# Altium schematic sheet 03_MCU1.SchDoc
size A4; DocumentNumber: 3; SheetNumber: 3; SheetTotal: 7
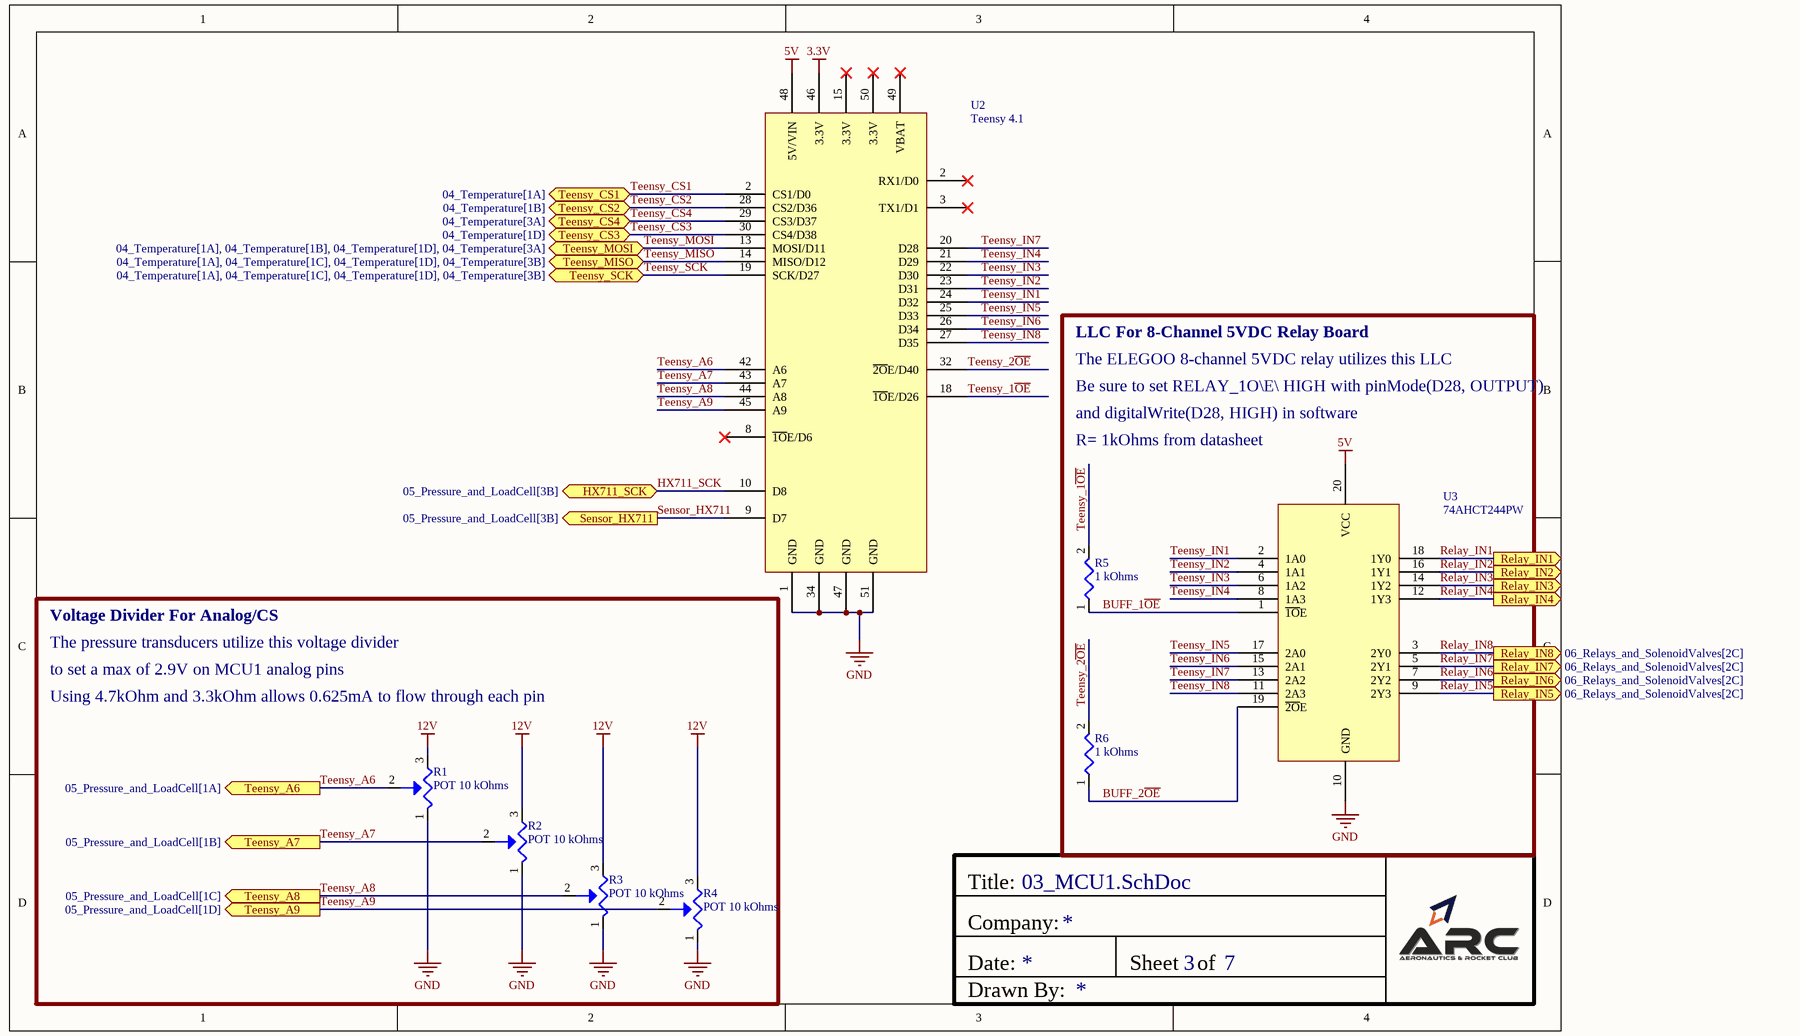
[diagram p0: 03_MCU1.SchDoc]

## Parts
R1  POT 10 kOhms  [3296WL 10K POT]
R2  POT 10 kOhms  [3296WL 10K POT]
R3  POT 10 kOhms  [3296WL 10K POT]
R4  POT 10 kOhms  [3296WL 10K POT]
R5  1 kOhms  [RESC2012X06N]
R6  1 kOhms  [RESC2012X06N]
U2  Teensy 4.1  [Teensy 4.1]
U3  74AHCT244PW  [74AHCT244PW]

## Ports
HX711_SCK (bidir, see 05_Pressure_and_LoadCell[3B]), Relay_IN1 (out, see 06_Relays_and_SolenoidValves[2C]), Relay_IN2 (out, see 06_Relays_and_SolenoidValves[2C]), Relay_IN3 (out, see 06_Relays_and_SolenoidValves[2C]), Relay_IN4 (out, see 06_Relays_and_SolenoidValves[2C]), Relay_IN5 (out, see 06_Relays_and_SolenoidValves[2C]), Relay_IN6 (out, see 06_Relays_and_SolenoidValves[2C]), Relay_IN7 (out, see 06_Relays_and_SolenoidValves[2C]), Relay_IN8 (out, see 06_Relays_and_SolenoidValves[2C]), Sensor_HX711 (out, see 05_Pressure_and_LoadCell[3B]), Teensy_A6 (out, see 05_Pressure_and_LoadCell[1A]), Teensy_A7 (out, see 05_Pressure_and_LoadCell[1B]), Teensy_A8 (out, see 05_Pressure_and_LoadCell[1C]), Teensy_A9 (out, see 05_Pressure_and_LoadCell[1D]), Teensy_CS1 (bidir, see 04_Temperature[1A]), Teensy_CS2 (bidir, see 04_Temperature[1B]), Teensy_CS3 (bidir, see 04_Temperature[1D]), Teensy_CS4 (bidir, see 04_Temperature[3A]), Teensy_MISO (bidir, see 04_Temperature[1A], 04_Temperature[1C], 04_Temperature[1D], 04_Temperature[3B]), Teensy_MOSI (bidir, see 04_Temperature[1A], 04_Temperature[1B], 04_Temperature[1D], 04_Temperature[3A]), Teensy_SCK (bidir, see 04_Temperature[1A], 04_Temperature[1C], 04_Temperature[1D], 04_Temperature[3B])

## Nets
3.3V: U2.46(3.3V)
5V: U2.48(5V/VIN) U3.20(VCC)
12V: R1.3 R2.3 R3.3 R4.3
GND: R1.1 R2.1 R3.1 R4.1 U2.1(GND) U2.34(GND) U2.47(GND) U2.51(GND) U3.10(GND)
BUFF_1~{OE}: R5.1 U3.1(~{1O}E)
BUFF_2~{OE}: R6.1 U3.19(~{2O}E)
HX711_SCK: U2.10(D8) ; port HX711_SCK
Relay_IN1: U3.18(1Y0) ; port Relay_IN1
Relay_IN2: U3.16(1Y1) ; port Relay_IN2
Relay_IN3: U3.14(1Y2) ; port Relay_IN3
Relay_IN4: U3.12(1Y3) ; port Relay_IN4
Relay_IN5: U3.9(2Y3) ; port Relay_IN5
Relay_IN6: U3.7(2Y2) ; port Relay_IN6
Relay_IN7: U3.5(2Y1) ; port Relay_IN7
Relay_IN8: U3.3(2Y0) ; port Relay_IN8
Sensor_HX711: U2.9(D7) ; port Sensor_HX711
Teensy_1~{OE}: R5.2 U2.18(~{1O}E/D26)
Teensy_2~{OE}: R6.2 U2.32(~{2O}E/D40)
Teensy_A6: R1.2 U2.42(A6) ; port Teensy_A6
Teensy_A7: R2.2 U2.43(A7) ; port Teensy_A7
Teensy_A8: R3.2 U2.44(A8) ; port Teensy_A8
Teensy_A9: R4.2 U2.45(A9) ; port Teensy_A9
Teensy_CS1: U2.2(CS1/D0) ; port Teensy_CS1
Teensy_CS2: U2.28(CS2/D36) ; port Teensy_CS2
Teensy_CS3: U2.30(CS4/D38) ; port Teensy_CS3
Teensy_CS4: U2.29(CS3/D37) ; port Teensy_CS4
Teensy_IN1: U2.24(D32) U3.2(1A0)
Teensy_IN2: U2.23(D31) U3.4(1A1)
Teensy_IN3: U2.22(D30) U3.6(1A2)
Teensy_IN4: U2.21(D29) U3.8(1A3)
Teensy_IN5: U2.25(D33) U3.17(2A0)
Teensy_IN6: U2.26(D34) U3.15(2A1)
Teensy_IN7: U2.20(D28) U3.13(2A2)
Teensy_IN8: U2.27(D35) U3.11(2A3)
Teensy_MISO: U2.14(MISO/D12) ; port Teensy_MISO
Teensy_MOSI: U2.13(MOSI/D11) ; port Teensy_MOSI
Teensy_SCK: U2.19(SCK/D27) ; port Teensy_SCK

Not connected (* = marked no-connect by the designer): U2 3(TX1/D1)* 8(~{1O}E/D6)* 15(3.3V)* 49(VBAT)* 50(3.3V)*

## Notes on the sheet
- The ELEGOO 8-channel 5VDC relay utilizes this LLC
- LLC For 8-Channel 5VDC Relay Board
- Be sure to set RELAY_1O\E\ HIGH with pinMode(D28, OUTPUT)
- and digitalWrite(D28, HIGH) in software
- R= 1kOhms from datasheet
- Voltage Divider For Analog/CS
- The pressure transducers utilize this voltage divider
- to set a max of 2.9V on MCU1 analog pins
- Using 4.7kOhm and 3.3kOhm allows 0.625mA to flow through each pin
- Title:
- Company:
- Date:
- Sheet
- of
- Drawn By:

## Library data of the parts
R1-R4 = 3296W-1-103LF: 10 kOhms 0.5W, 1/2W PC Pins Through Hole Trimmer Potentiometer Cermet 25.0 Turn Top Adjustment; Manufacturer: Bourns; Tolerance: 10%; Actuator Orientation: Vertical; Actuator Type: SCREW; Number of Turns: 25; Power: 500mW; Rated Temperature: 70°C; Value: 10kR; Resistance Law: Linear; Rotational Angle: 9000°; Temperature Coefficient: -100100ppm/°C; Lead Diameter: 0.51mm; Lead Length: 6.4mm; Package Height: 10.03mm; Package Length: 9.53mm; Package Width: 4.83mm; Supplier: Digi-Key; Supplier Part Number: 3296W-103LF-ND; Manufacturer Part Number: 3296W-1-103LF; RoHS: Yes; Category: Variable Resistors and Potentiometers; Stock: 20859; Pricing: 1=2.43000, 10=2.13800, 25=1.91680, 50=1.84320, 100=1.76950, 250=1.69580, 500=1.40088, 1000=1.32714, 5000=1.10595 (USD); Mounting Technology: Through Hole; Pins: 3; Package Shape: Rectangular; Case/Package: 3819; Terminal Finish: Tin; Min Operating Temperature: -55°C; Max Operating Temperature: 125°C; JESD-609 Code: e3; Resistor Type: TRIMMER; Construction: Trimmer Pot; Package Style: PCB MountMeter; Packaging: Rail/Tube; Technology: CERMET; Termination: Wire; RoHS Compliant: Yes; Reach SVHC Compliant: No; ComponentLink1URL: https://datasheet.ciiva.com:443/pdfs/VipMasterIC/IC/BOUR/BOUR-S-A0008796795/BOUR-S-A0008796795-1.pdf?src-supplier=IHS+Markit; ComponentLink1Description: https://datasheet.ciiva.com:443/pdfs/VipMasterIC/IC/BOUR/BOUR-S-A0008796795/BOUR-S-A0008796795-1.pdf?src-supplier=IHS+Markit; ComponentLink2URL: https://datasheet.ciiva.com/19454/853572-19454866.pdf?src-supplier=Jameco; ComponentLink2Description: https://datasheet.ciiva.com/19454/853572-19454866.pdf?src-supplier=Jameco; ComponentLink3URL: https://datasheet.ciiva.com/14173/ew3296-dat-e-14173022.pdf?src-supplier=Distrelec; ComponentLink3Description: https://datasheet.ciiva.com/14173/ew3296-dat-e-14173022.pdf?src-supplier=Distrelec; ComponentLink4URL: https://datasheet.ciiva.com/18411/70153578-18411561.pdf?src-supplier=Allied+Electronics; ComponentLink4Description: https://datasheet.ciiva.com/18411/70153578-18411561.pdf?src-supplier=Allied+Electronics; ComponentLink5URL: https://datasheet.ciiva.com/1131/1815117-1131273.pdf?src-supplier=Element14; ComponentLink5Description: https://datasheet.ciiva.com/1131/1815117-1131273.pdf?src-supplier=Element14; ComponentLink6URL: https://datasheet.ciiva.com/3266/3296-3266187.pdf?src-supplier=Avnet; ComponentLink6Description: https://datasheet.ciiva.com/3266/3296-3266187.pdf?src-supplier=Avnet; ComponentLink7URL: https://datasheet.ciiva.com/2156/3296-2156893.pdf?src-supplier=Digi-Key; ComponentLink7Description: https://datasheet.ciiva.com/2156/3296-2156893.pdf?src-supplier=Digi-Key
R5 R6 = RC0805FR-7W1KL Yageo: 1 kOhms ±1% 0.25W, 1/4W Chip Resistor 0805 (2012 Metric) Moisture Resistant Thick Film; Manufacturer: Yageo; Value: 1kR; Supplier 1: Digi-Key; Manufacturer Part Number: RC0805FR-7W1KL; RoHS: Yes; Category: Chip SMD Resistors; Stock 1: 15000; Pricing 1: 5000=0.01838, 10000=0.01715, 25000=0.01629, 50000=0.01596, 125000=0.01562 (USD); Case/Package: 0805; Tolerance: 1%; RoHS Compliant: Yes; Supplier Part Number 1: 13-RC0805FR-7W1KLTR-ND
U2 = Teensy 4.1: RT1062 Teensy 4.1 - ARM® Cortex®-M7 MCU 32-Bit Embedded Evaluation Board 600 MHz 100 mA RTC Built-in microSD Card reader Arduino IDE compatible; Manufacturer: SparkFun; Manufacturer Part Number: DEV-16996; Supplier 1: Digi-Key; RoHS: No; Category: Embedded Processors and Controllers; Stock 1: 300; Pricing 1: 1=31.88000 (USD); Supplier Part Number 1: 1568-DEV-16996-ND
U3 = 74AHCT244PW: Octal Tri-State Buffer NON-INVERT 5.5V 20TSSOP; Manufacturer: NXP Semiconductors; Manufacturer Part Number: 74AHCT244PW,118; Number of Channels: 8; Operating Supply Voltage: 5V; Propagation Delay: 8.4ns; Min Supply Voltage: 4.5V; Logic Function: Buffer,Inverting; Number of Elements: 2; Number of Bits per Element: 4; High Level Output Current: -8mA; Low Level Output Current: 8mA; Polarity: Non-Inverting; Turn-On Delay Time: 14.5ns; Quiescent Current: 4uA; Output Type: 3-STATE; Supplier 1: Digi-Key; RoHS: Yes; Category: Uncategorized; Mounting Technology: Surface Mount; Case/Package: TSSOP; Pins: 20; Contact Plating: Gold; Min Operating Temperature: -40°C; Max Operating Temperature: 125°C; Number of Inputs: 8; Number of Outputs: 8; Packaging: Tape and Reel; Max Supply Voltage: 5.5V; Package Quantity: 2500; Number of Input Lines: 8; Number of Output Lines: 8; Series: 74AHCT; Technology: CMOS; Radiation Hardening: No; RoHS Compliant: Yes; Lead Free: Lead Free; ComponentLink1URL: https://datasheet.ciiva.com/1832/74ahc-ahct244-1832788.pdf?src-supplier=Digi-Key; ComponentLink1Description: https://datasheet.ciiva.com/1832/74ahc-ahct244-1832788.pdf?src-supplier=Digi-Key; ComponentLink2URL: https://datasheet.ciiva.com/1832/74ahc-ahct244-1832789.pdf?src-supplier=Digi-Key; ComponentLink2Description: https://datasheet.ciiva.com/1832/74ahc-ahct244-1832789.pdf?src-supplier=Digi-Key; ComponentLink3URL: https://datasheet.ciiva.com/1832/74ahc-ahct244-1832790.pdf?src-supplier=Digi-Key; ComponentLink3Description: https://datasheet.ciiva.com/1832/74ahc-ahct244-1832790.pdf?src-supplier=Digi-Key; ComponentLink4URL: https://datasheet.ciiva.com/1832/74ahc-ahct244-1832792.pdf?src-supplier=Digi-Key; ComponentLink4Description: https://datasheet.ciiva.com/1832/74ahc-ahct244-1832792.pdf?src-supplier=Digi-Key; Supplier Part Number 1: 1727-4002-2-ND